# Altium schematic sheet GH08172_buttons.SchDoc
size A4; Revision: A.1(PCB.SCH)
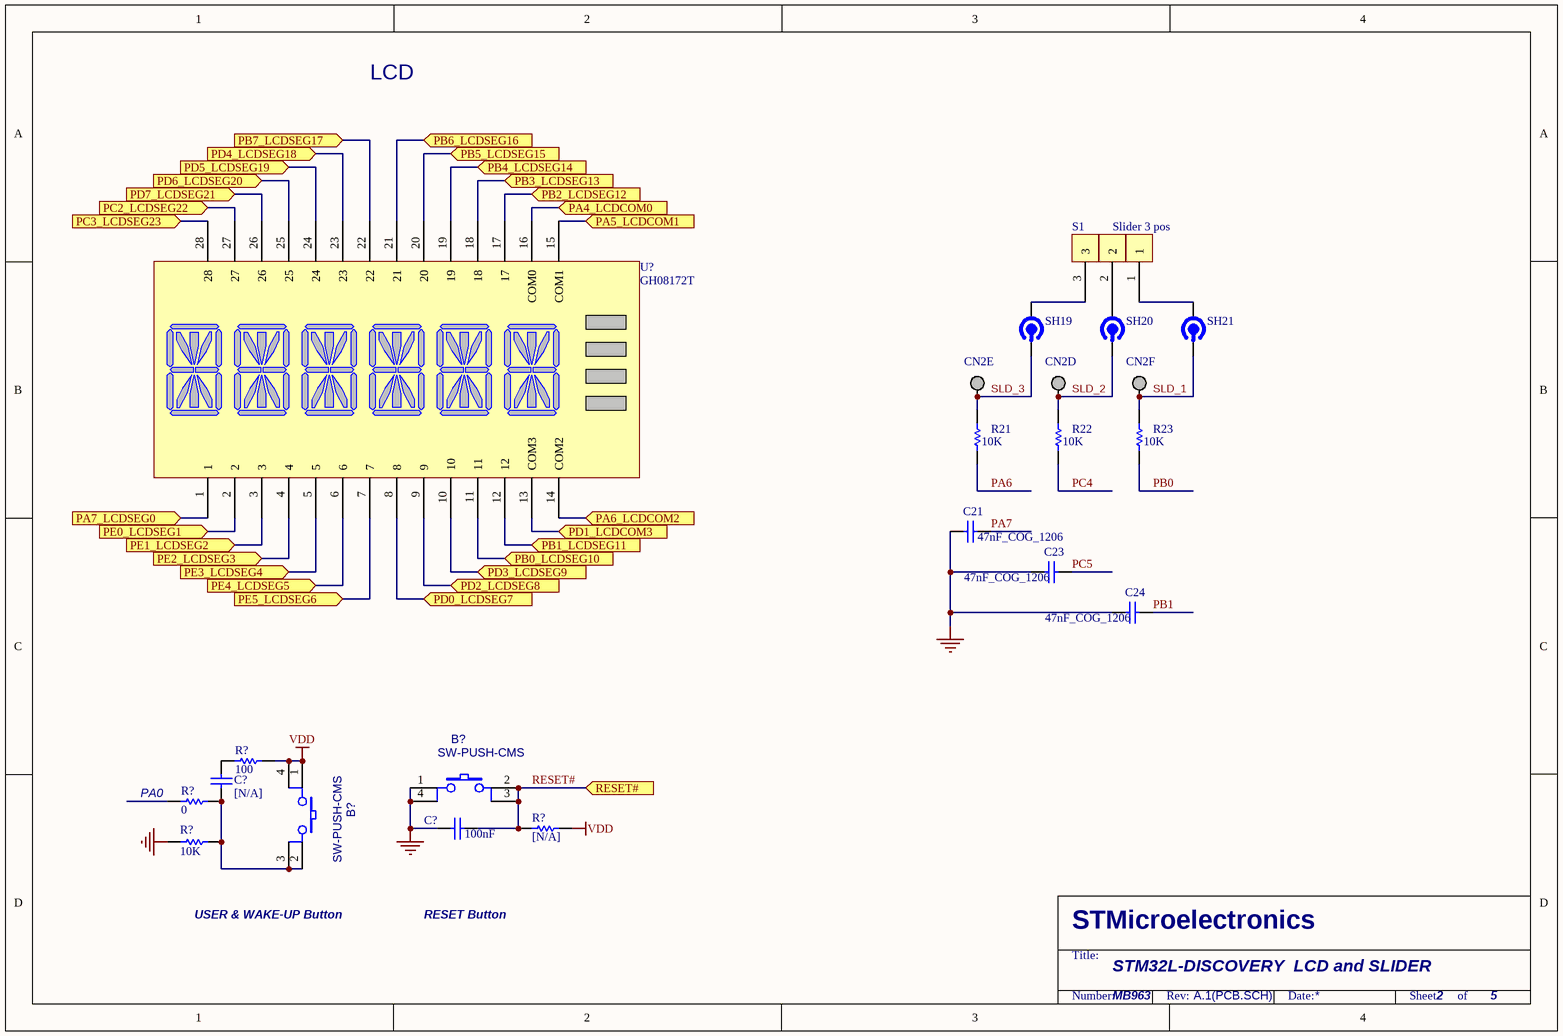
[diagram p0: GH08172_buttons.SchDoc]

## Parts
(Parts that share a designator on the sheet are numbered #1, #2 ... from top to bottom, then left to right.)
B?#1  SW-PUSH-CMS  [BP1CMS]
B?#2  SW-PUSH-CMS  [BP1CMS]
C21  47nF_COG_1206  [1206]
C23  47nF_COG_1206  [1206]
C24  47nF_COG_1206  [1206]
C?#1  [N/A]  [0603C]
C?#2  100nF  [0603C]
CN2  Header_6  [SIP6]  (value not drawn)  (parts D,E,F of 6)
R21  10K  [0603R]
R22  10K  [0603R]
R23  10K  [0603R]
R?#1  100  [0603R]
R?#2  0  [0603R]
R?#3  [N/A]  [0603R]
R?#4  10K  [0603R]
S1  Slider 3 pos  [Slider 3-2]
SH19  SHUNT  [SHUNT]  (value not drawn)
SH20  SHUNT  [SHUNT]  (value not drawn)
SH21  SHUNT  [SHUNT]  (value not drawn)
U?  GH08172T  [DIP28]

## Ports
PA4_LCDCOM0 (in), PA5_LCDCOM1 (in), PA6_LCDCOM2 (in), PA7_LCDSEG0 (in), PB0_LCDSEG10 (in), PB1_LCDSEG11 (in), PB2_LCDSEG12 (in), PB3_LCDSEG13 (in), PB4_LCDSEG14 (in), PB5_LCDSEG15 (in), PB6_LCDSEG16 (in), PB7_LCDSEG17 (in), PC2_LCDSEG22 (in), PC3_LCDSEG23 (in), PD0_LCDSEG7 (in), PD1_LCDCOM3 (in), PD2_LCDSEG8 (in), PD3_LCDSEG9 (in), PD4_LCDSEG18 (in), PD5_LCDSEG19 (in), PD6_LCDSEG20 (in), PD7_LCDSEG21 (in), PE0_LCDSEG1 (in), PE1_LCDSEG2 (in), PE2_LCDSEG3 (in), PE3_LCDSEG4 (in), PE4_LCDSEG5 (in), PE5_LCDSEG6 (in), RESET# (in)

## Nets
GND: B?#1.1 B?#1.4 C21.1 C23.1 C24.1 C?#2.1 R?#4.1
VDD: B?#2.1 B?#2.4 R?#1.1 R?#3.2
PA4_LCDCOM0: U?.16(COM0) ; port PA4_LCDCOM0
PA5_LCDCOM1: U?.15(COM1) ; port PA5_LCDCOM1
PA6: R21.1
PA6_LCDCOM2: U?.14(COM2) ; port PA6_LCDCOM2
PA7: C21.2
PA7_LCDSEG0: U?.1 ; port PA7_LCDSEG0
PB0: R23.1
PB0_LCDSEG10: U?.11 ; port PB0_LCDSEG10
PB1: C24.2
PB1_LCDSEG11: U?.12 ; port PB1_LCDSEG11
PB2_LCDSEG12: U?.17 ; port PB2_LCDSEG12
PB3_LCDSEG13: U?.18 ; port PB3_LCDSEG13
PB4_LCDSEG14: U?.19 ; port PB4_LCDSEG14
PB5_LCDSEG15: U?.20 ; port PB5_LCDSEG15
PB6_LCDSEG16: U?.21 ; port PB6_LCDSEG16
PB7_LCDSEG17: U?.22 ; port PB7_LCDSEG17
PC2_LCDSEG22: U?.27 ; port PC2_LCDSEG22
PC3_LCDSEG23: U?.28 ; port PC3_LCDSEG23
PC4: R22.1
PC5: C23.2
PD0_LCDSEG7: U?.8 ; port PD0_LCDSEG7
PD1_LCDCOM3: U?.13(COM3) ; port PD1_LCDCOM3
PD2_LCDSEG8: U?.9 ; port PD2_LCDSEG8
PD3_LCDSEG9: U?.10 ; port PD3_LCDSEG9
PD4_LCDSEG18: U?.23 ; port PD4_LCDSEG18
PD5_LCDSEG19: U?.24 ; port PD5_LCDSEG19
PD6_LCDSEG20: U?.25 ; port PD6_LCDSEG20
PD7_LCDSEG21: U?.26 ; port PD7_LCDSEG21
PE0_LCDSEG1: U?.2 ; port PE0_LCDSEG1
PE1_LCDSEG2: U?.3 ; port PE1_LCDSEG2
PE2_LCDSEG3: U?.4 ; port PE2_LCDSEG3
PE3_LCDSEG4: U?.5 ; port PE3_LCDSEG4
PE4_LCDSEG5: U?.6 ; port PE4_LCDSEG5
PE5_LCDSEG6: U?.7 ; port PE5_LCDSEG6
RESET#: B?#1.2 B?#1.3 C?#2.2 R?#3.1 ; port RESET#
SLD_1: CN2.6 R23.2 SH21.2
SLD_2: CN2.4 R22.2 SH20.2
SLD_3: CN2.5 R21.2 SH19.2
NetB?#2_2: B?#2.2 B?#2.3 C?#1.2 R?#2.1 R?#4.2
NetC?#1_1: C?#1.1 R?#1.2
NetS1_1: S1.1 SH21.1
NetS1_2: S1.2 SH20.1
NetS1_3: S1.3 SH19.1

Not connected (* = marked no-connect by the designer): R?#2 2

## Notes on the sheet
- LCD
- (near R?#2) PA0
- USER & WAKE-UP Button
- RESET Button
- STM32L-DISCOVERY  LCD and SLIDER
- MB963
- 2
- 5
- STMicroelectronics
- Title:
- Number:
- Rev:
- Date:
- Sheet       of

## Library data of the parts
B?#1 = SW-PUSH-CMS: Non-Open Push-Button 0.1A 24V; Manuf_1: FARNELL; Manuf_Part_1: 535-930; Ref St: 9180120; cap_dec: ---; support: -----
B?#2 = SW-PUSH-CMS: Non-Open Push-Button 0.1A 24V; Manuf_1: FARNELL; Manuf_Part_1: 535-930; Ref St: 9180120; cap_dec: ---
C21 C23 C24 = CAP SMD 1206 COG 47000PF 50V 5%: 1206 COG 47nF; Order code RS: 546-0097; Rated voltage: 50V; Tolerance: 5%; Value: 47nF; Power: *; Technology: COG; Temperature Factor: *; Temperature Min: -55°C; Temperature Max: +125°C
C?#1 = CAP: Capacitor; Value: 100pF; Fitted: NO; Published: 8-Jun-2000; Revision: July-2002: Re-released for DXP Platform.; Publisher: Altium Limited
C?#2 = CAP: Capacitor; Value: 100pF; Published: 8-Jun-2000; Revision: July-2002: Re-released for DXP Platform.; Publisher: Altium Limited
CN2 = Header_6: Fitted/Not fitted: Not fitted
R21-R23 = Res1: 0603 10K 5%; Value: 1K; Published: 8-Jun-2000; Revision: July-2002: Re-released for DXP Platform.; Publisher: Altium Limited
R?#1 = Res1: Resistor; Value: 1K; Published: 8-Jun-2000; Revision: July-2002: Re-released for DXP Platform.; Publisher: Altium Limited
R?#2 = Res1: Resistor; Published: 8-Jun-2000; Revision: July-2002: Re-released for DXP Platform.; Publisher: Altium Limited; Value: 0
R?#3 = res1: Resistor; Value: 1K; Fitted: NO; Published: 8-Jun-2000; Revision: July-2002: Re-released for DXP Platform.; Publisher: Altium Limited
R?#4 = res1: Resistor; Value: 1K; Published: 8-Jun-2000; Revision: July-2002: Re-released for DXP Platform.; Publisher: Altium Limited
S1 = Slider 3 pos: plan de cuivre recouvert de vernis
U? = GH08172T: Provided: ST